# Altium schematic sheet PDOC.SchDoc
size Letter
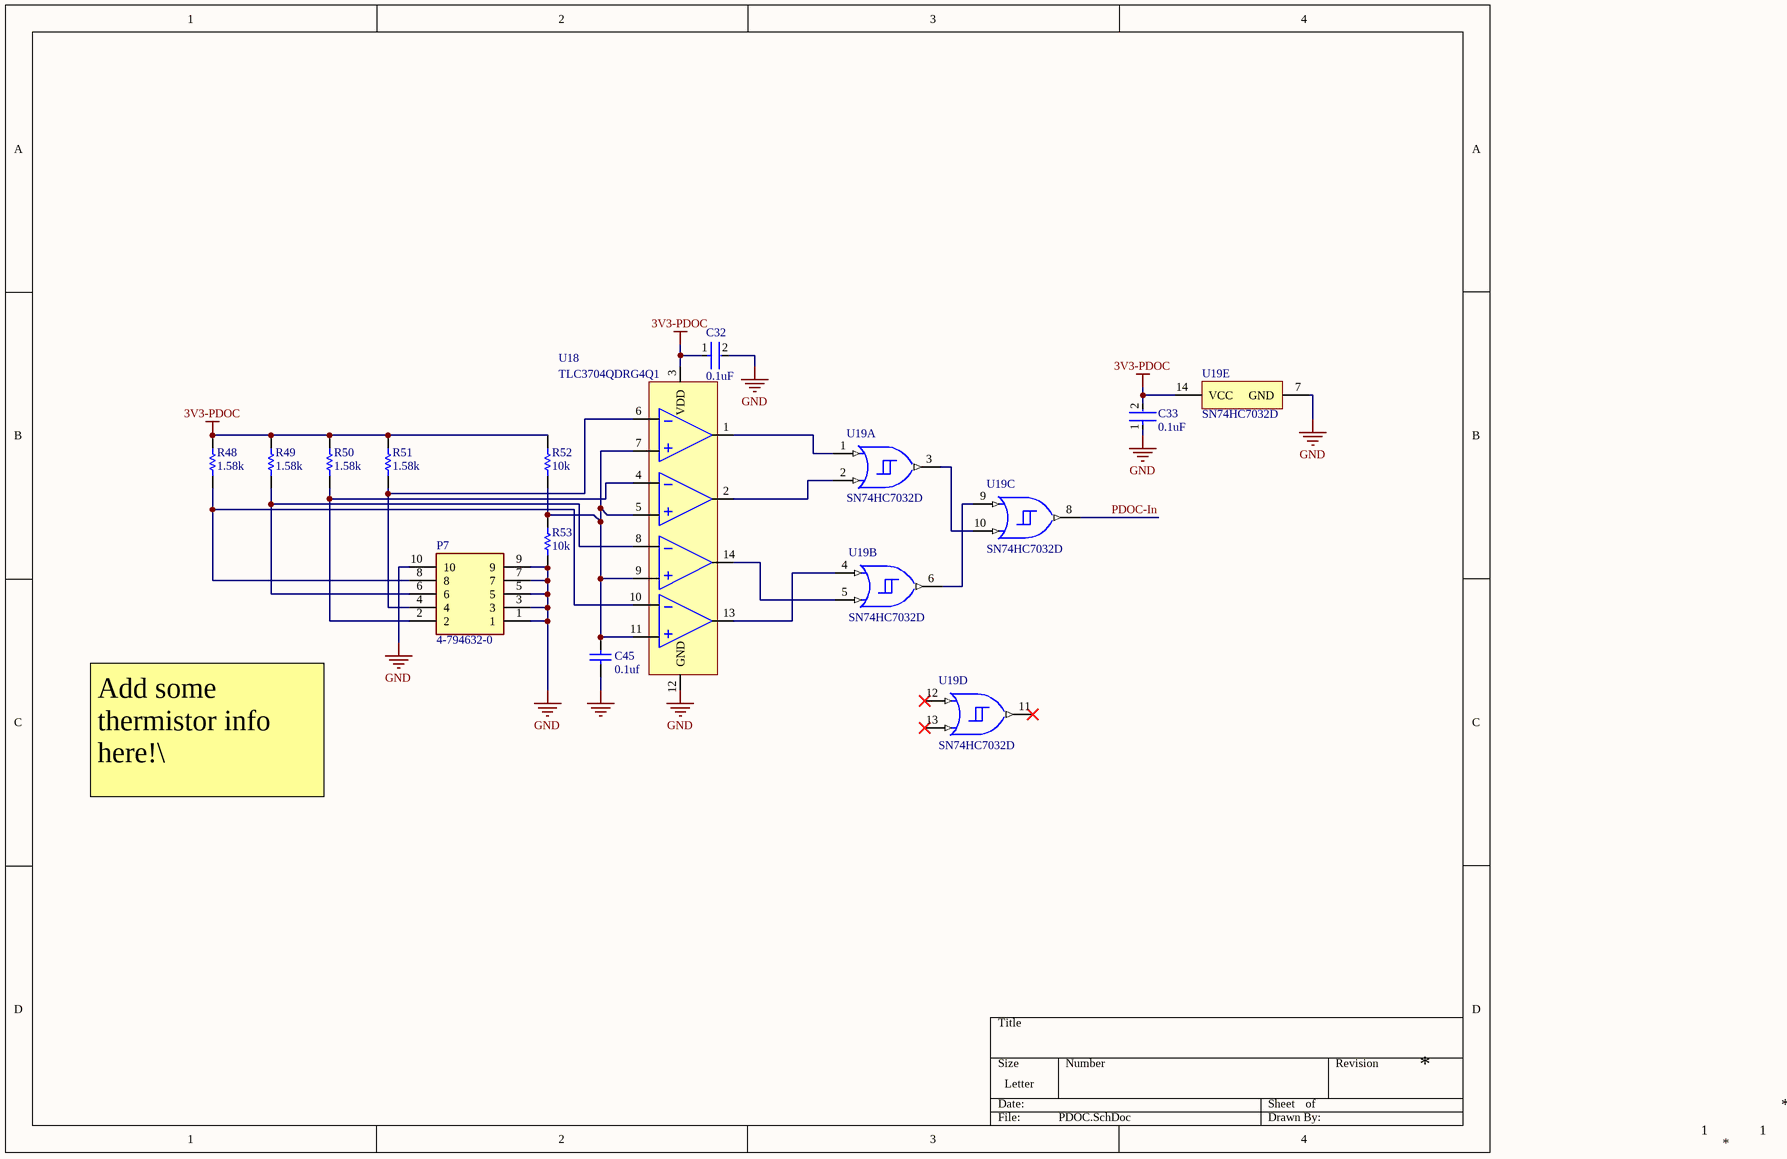
[diagram p0: PDOC.SchDoc]

## Parts
C32  0.1uF  [FP-C0603-CJ-MFG]
C33  0.1uF  [FP-C0603-CJ-MFG]
C45  value 0.1uf  [CAPC1608X95N]  (hidden comment: Cap)
P7  4-794632-0  [SHDR10W82P300_2X5_1586X686X944P]
R48  1.58k  [RESC1608X55N]
R49  1.58k  [RESC1608X55N]
R50  1.58k  [RESC1608X55N]
R51  1.58k  [RESC1608X55N]
R52  10k  [RESC1608X55N]
R53  10k  [RESC1608X55N]
U18  TLC3704QDRG4Q1  [SOIC14]
U19  SN74HC7032D  [D0014A_L]  (parts A,B,C,D,E of 5)

## Nets
3V3-PDOC: C32.1 C33.2 R48.2 R49.2 R50.2 R51.2 R52.2 U18.3(VDD) U19.14(VCC)
GND: C32.2 C33.1 C45.1 P7.1 P7.3 P7.5 P7.7 P7.9 P7.10 R53.1 U18.12(GND) U19.7(GND)
PDOC-In: U19.8(3Y)
NetC45_2: C45.2 R52.1 R53.2 U18.5(In2+) U18.7(In1+) U18.9(In3+) U18.11(In4+)
NetP7_2: P7.2 R50.1 U18.4(In2-)
NetP7_4: P7.4 R51.1 U18.6(In1-)
NetP7_6: P7.6 R49.1 U18.8(In3-)
NetP7_8: P7.8 R48.1 U18.10(In4-)
NetU18_1: U18.1(Out1) U19.1(1A)
NetU18_2: U18.2(Out2) U19.2(1B)
NetU18_13: U18.13(Out4) U19.4(2A)
NetU18_14: U18.14(Out3) U19.5(2B)
NetU19_3: U19.3(1Y) U19.10(3B)
NetU19_6: U19.6(2Y) U19.9(3A)

Not connected (* = marked no-connect by the designer): U19 11(4Y)* 12(4A)* 13(4B)*

## Notes on the sheet
- Add some thermistor info here!\
- 1

## Library data of the parts
C32 C33 = CMP-2006-03300-2: CAP CER 0.1UF 50V X7R 0603; Manufacturer Part Number: C0603X104K5RACTU; Manufacturer: Kemet; Capacitance: 100nF; Material: Ceramic; Tolerance: 10%; Value: 100nF; Temperature Coefficient: 15%; Temperature Range High: +125°C; Temperature Range Low: -55°C; Voltage: 50V; ComponentLink2Description: Datasheet; RoHS: TRUE; ComponentLink2URL: https://content.kemet.com/datasheets/KEM_C1013_X7R_FT-CAP_SMD.pdf; Device Class L3: Ceramic Capacitors; Device Class L2: Capacitors; Package: C0603-CJ; Height: 0.95mm; Device Class L1: Passive Components; Temperature Characteristic: X7R; Lead Free: Yes; Digikey Description: CAP CER 0.1UF 50V X7R 0603; Automotive: No; Mouser Description: Capacitor; Ceramic; Cap 0.1uF; Tol+10%; SMT; Flexible Termination; Vol-Rtg 50V; TR; Temperature: -55°C to +125°C; Octopart: https://octopart.com/c0603x104k5ractu-kemet-9145062; Category: Cap; Voltage Rating: 50V; Ipc Land Pattern Name: CAPC16080X80
C45 = Cap: 264-4630; Published: 8-Jun-2000; LatestRevisionDate: 17-Jul-2002; LatestRevisionNote: Re-released for DXP Platform.; PackageReference: RAD-0.3; Publisher: Altium Limited; PackageDescription: Radial Cap, Thru-Hole; 2 Leads; 0.3 in Pin Spacing
P7 = 4-794632-0: Connector; Manufacturer_Name: TE Connectivity; Datasheet Link: https://www.mouser.com/ProductDetail/TE-Connectivity-AMP/4-794632-0?qs=Rd%252BN518myCyGOpGRvqIhCg%3D%3D; Height: 9.44mm; Manufacturer_Part_Number: 4-794632-0; Mouser Part Number: 571-4-794632-0; Mouser Price/Stock: https://www.mouser.co.uk/ProductDetail/TE-Connectivity-AMP/4-794632-0?qs=Rd%252BN518myCyGOpGRvqIhCg%3D%3D
R48-R51 = RC0805FR-071K58L: 1.58k 0805 1% 1/8W; Resistance: 1.58kR; Temperature Coefficient: 100ppm/°C; Power Rating: 125mW; Voltage Rating: 150V; MPN: *; Category: *; Supplier 1: Digi-Key; RoHS: Yes; Case/Package: 0805; Contact Plating: Tin; Case Code (Metric): 2012; Case Code (Imperial): 0805; Min Operating Temperature: -55°C; Max Operating Temperature: 155°C; Tolerance: 1%; Composition: Thick Film; Package Quantity: 1; Packaging: Tape and Reel; Number of Terminations: 2; Termination: SMD/SMT; Military Standard: Not; Max Power Dissipation: 125mW; Voltage Rating (DC): 150V; Features: Moisture Resistant; Length: 0.079inch; Height: 0.024inch; Width: 0.049inch; Depth: 1.25mm; Radiation Hardening: No; Lead Free: Lead Free; ComponentLink1URL: https://datasheet.ciiva.com/2457/pyu-r-int-thick-7-2457440.pdf?src-supplier=Digi-Key; ComponentLink1Description: https://datasheet.ciiva.com/2457/pyu-r-int-thick-7-2457440.pdf?src-supplier=Digi-Key; ComponentLink2URL: https://datasheet.ciiva.com/2457/pyu-r-int-thick-7-2457441.pdf?src-supplier=Digi-Key; ComponentLink2Description: https://datasheet.ciiva.com/2457/pyu-r-int-thick-7-2457441.pdf?src-supplier=Digi-Key; ComponentLink3URL: https://datasheet.ciiva.com/2457/pyu-r-int-thick-7-2457442.pdf?src-supplier=Digi-Key; ComponentLink3Description: https://datasheet.ciiva.com/2457/pyu-r-int-thick-7-2457442.pdf?src-supplier=Digi-Key; ComponentLink4URL: https://datasheet.ciiva.com/17082/rc0805-17082718.pdf?src-supplier=Future+Electronics; ComponentLink4Description: https://datasheet.ciiva.com/17082/rc0805-17082718.pdf?src-supplier=Future+Electronics; Supplier Part Number 1: 311-1.58KCRCT-ND
R52 R53 = RC0805JR-0710KL: 10k E0805 1% 1/8W; Tolerance: 5%; Resistance: 10kR; Power Rating: 125mW; Temperature Coefficient: 100ppm/°C; Voltage Rating: 150V; MPN: *; Category: *; Supplier 1: Digi-Key; RoHS: Yes; Case/Package: 0805; Contact Plating: Tin; Case Code (Imperial): 0805; Case Code (Metric): 2012; Min Operating Temperature: -55°C; Max Operating Temperature: 155°C; Composition: Thick Film; Packaging: Tape and Reel; Termination: SMD/SMT; Military Standard: Not; Length: 2mm; Height: 0.5mm; Width: 1.25mm; Depth: 1.25mm; Radiation Hardening: No; REACH SVHC: Unknown; Lead Free: Lead Free; ComponentLink1URL: https://datasheet.ciiva.com/7941/444164-7941870.pdf?src-supplier=Element14; ComponentLink1Description: https://datasheet.ciiva.com/7941/444164-7941870.pdf?src-supplier=Element14; ComponentLink2URL: https://datasheet.ciiva.com/7941/444164-7941871.pdf?src-supplier=Element14; ComponentLink2Description: https://datasheet.ciiva.com/7941/444164-7941871.pdf?src-supplier=Element14; ComponentLink3URL: https://datasheet.ciiva.com/7983/444164-7983765.pdf?src-supplier=Element14; ComponentLink3Description: https://datasheet.ciiva.com/7983/444164-7983765.pdf?src-supplier=Element14; Supplier Part Number 1: 311-10KARCT-ND
U18 = TLC3704QDRG4Q1: IC VOLT COMPARATOR QUAD 14-SOIC; Manufacturer 1: Texas Instruments; Common Mode Rejection Ratio: 84dB; Min Supply Voltage: 3V; Max Supply Voltage: 16V; Operating Supply Voltage: 5V; Nominal Supply Current: 80uA; Max Power Dissipation: 950mW; Number of Elements: 4; Input Offset Voltage (Vos): 5mV; Input Bias Current: 5pA; Output Current: 20mA; Quiescent Current: 175uA; Propagation Delay: 4.5us; Response Time: 0.3us; Power Supply Rejection Ratio (PSRR): 85dB; Output Type: TTL; Supplier 1: Digi-Key; Supplier Part Number 1: 296-23711-1-ND; Manufacturer Part Number 1: TLC3704QDRG4Q1; Stock 1: 3794; Pricing 1: 1=1.68000, 10=1.50700, 100=1.21100, 500=0.99498, 1000=0.82441 (USD); RoHS: Yes; Mount: Surface Mount; Case/Package: SOIC; Number of Pins: 14; Weight: 0.004318oz; Contact Plating: Gold; Min Operating Temperature: -40°C; Max Operating Temperature: 125°C; Packaging: Tape and Reel; Package Quantity: 2500; Max Supply Current: 80uA; Number of Bits: 4; Number of Channels: 4; Max Input Current: 5pA; Power Dissipation: 950mW; Type: General Purpose; Radiation Hardening: No; Lead Free: Lead Free; ComponentLink1URL: https://datasheet.ciiva.com/1828/tlc3704-q1-1828544.pdf?src-supplier=Digi-Key; ComponentLink1Description: https://datasheet.ciiva.com/1828/tlc3704-q1-1828544.pdf?src-supplier=Digi-Key; ComponentLink2URL: https://datasheet.ciiva.com/4464/sgls191a-104586-4464808.pdf?src-supplier=Mouser; ComponentLink2Description: https://datasheet.ciiva.com/4464/sgls191a-104586-4464808.pdf?src-supplier=Mouser; ComponentLink3URL: https://datasheet.ciiva.com/15131/getdatasheetpartid-331461-15131244.pdf?src-supplier=Verical; ComponentLink3Description: https://datasheet.ciiva.com/15131/getdatasheetpartid-331461-15131244.pdf?src-supplier=Verical; ComponentLink4URL: https://datasheet.ciiva.com/14391/tlc3704-q1-14391948.pdf?src-supplier=Avnet; ComponentLink4Description: https://datasheet.ciiva.com/14391/tlc3704-q1-14391948.pdf?src-supplier=Avnet; ComponentLink5URL: https://datasheet.ciiva.com/1828/tlc3704-q1-1828542.pdf?src-supplier=Digi-Key; ComponentLink5Description: https://datasheet.ciiva.com/1828/tlc3704-q1-1828542.pdf?src-supplier=Digi-Key; ComponentLink6URL: https://datasheet.ciiva.com/1828/tlc3704-q1-1828543.pdf?src-supplier=Digi-Key; ComponentLink6Description: https://datasheet.ciiva.com/1828/tlc3704-q1-1828543.pdf?src-supplier=Digi-Key
U19 = CMP-0781-00002-4: Quadruple Positive-OR Gates With Schmitt-Trigger Inputs, D0014A, TUBE; Manufacturer: Texas Instruments; Output Drive (IOL/IOH)(Max)(mA): 5.2/-5.2; Output Type: CMOS; Bits(#): 4; Rating: Catalog; VCC(Max)(V): 6; VCC(Min)(V): 2; ICC @ Nom Voltage(Max)(mA): 0.02; Voltage(Nom)(V): 5; tpd @ Nom Voltage(Max)(ns): 33; F @ Nom Voltage(Max)(Mhz): 70; Code_JEDEC: MS-012; Generic Part Number: SN74HC7032; PackageReference: D0014A; DatasheetVersion: SCLS036E; PackageVersion: http://www.ti.com/lit/ml/mpds177g/mpds177g.pdf; Operating Temperature Range(C): -40 to 85; Input Type: CMOS